# Altium schematic sheet Sheet2.SchDoc
size A4; SheetNumber: 2; SheetTotal: 3
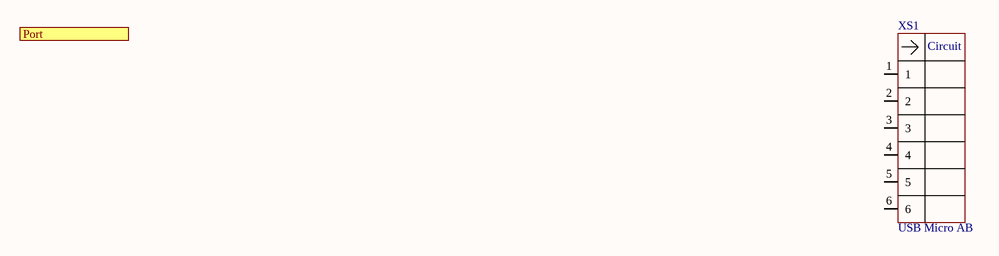
[diagram p0: Sheet2.SchDoc]

## Parts
XS1  USB Micro AB  [USB Micro AB]

## Ports
Port

## Nets

Not connected (* = marked no-connect by the designer): XS1 1 2 3 4 5 6

## Notes on the sheet
- (in symbol USB Micro AB) Circuit

## Library data of the parts
XS1 = USB Micro AB: Part Number: USB Micro AB; HelpURL: https://www.hirose.co.jp/cataloge_hp/ed_ZX_20140804.pdf